# Altium schematic sheet MCU.SchDoc
size A4; DocumentNumber: 4; SheetNumber: 3; SheetTotal: 5
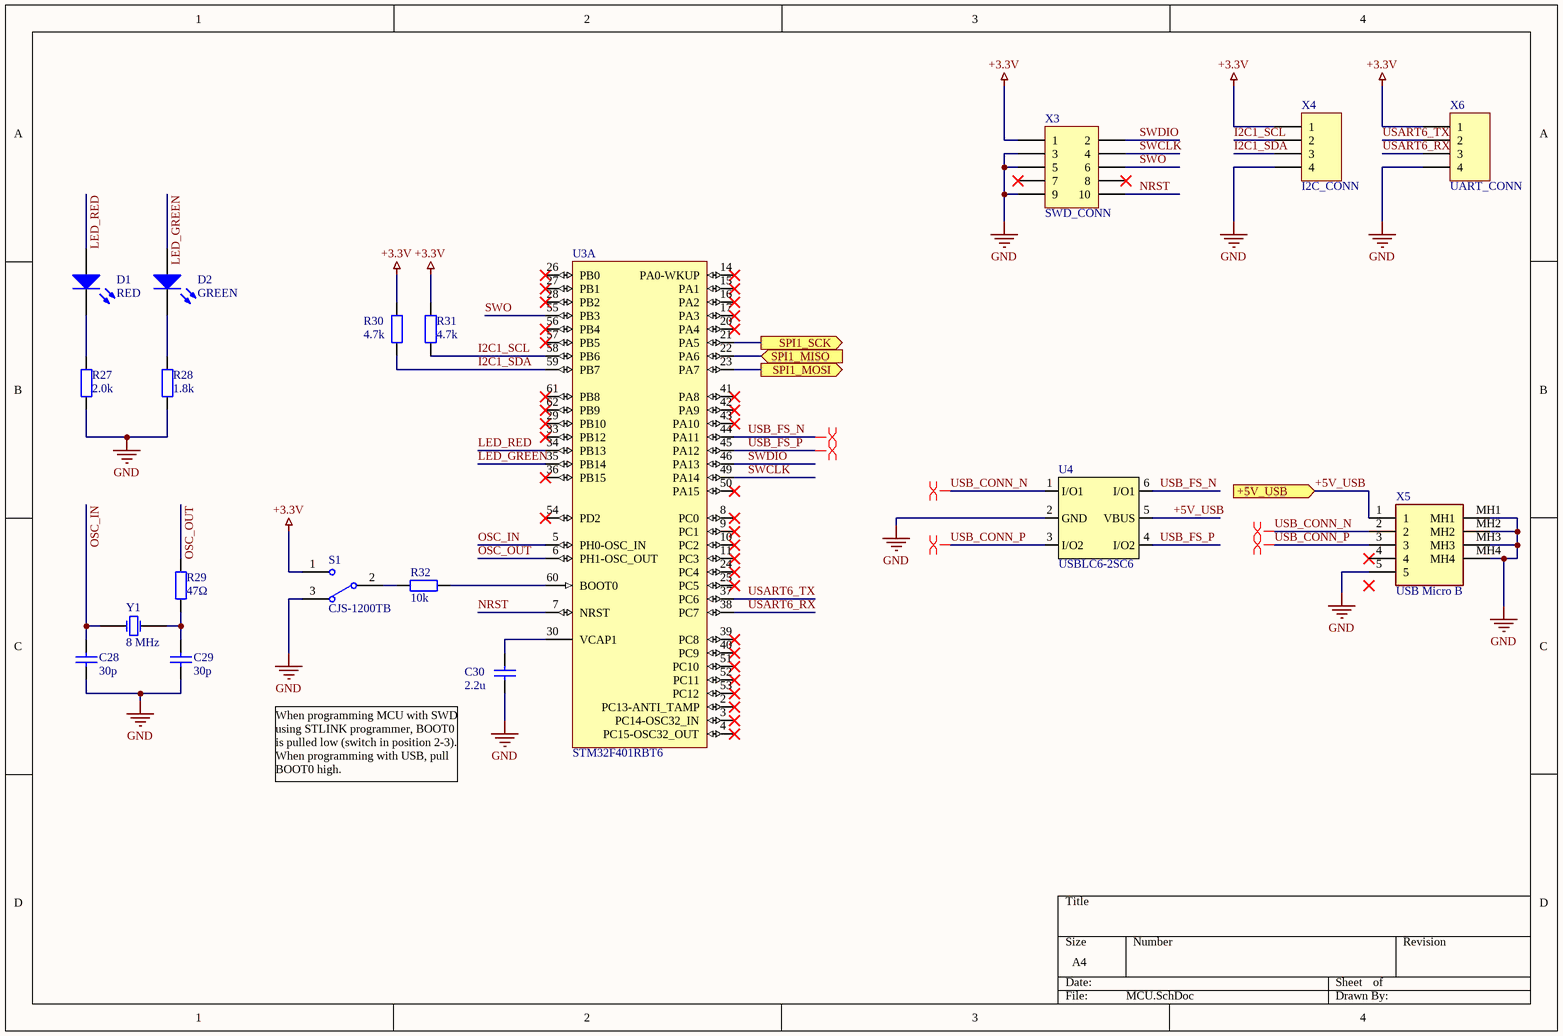
[diagram p0: MCU.SchDoc]

## Parts
C28  30p  [CAPC1608X87N]
C29  30p  [CAPC1608X87N]
C30  2.2u  [CAPC2012X110N]
D1  RED  [LEDC2012X110N]
D2  GREEN  [LEDC2012X110N]
R27  2.0k  [RESC1608X55N]
R28  1.8k  [RESC1608X55N]
R29  47Ω  [RESC1608X55N]
R30  4.7k  [RESC1608X55N]
R31  4.7k  [RESC1608X55N]
R32  10k  [RESC1608X55N]
S1  CJS-1200TB  [B-TYPE]
U3  STM32F401RBT6  [QFP50P1200X1200X160-64N]  (part A of 2)
U4  USBLC6-2SC6  [SOT95P280X145-6N]
X3  SWD_CONN  [SHDR10W55P200_2X5_1265X630X640P]
X4  I2C_CONN  [SHDR4W65P0X254_1X4_1262X660X1216P]
X5  USB Micro B  [UJ2MIBH24SMTTR]
X6  UART_CONN  [SHDR4W65P0X254_1X4_1262X660X1216P]
Y1  8 MHz  [ECS080185PXJESTR]

## Ports
+5V_USB (in), SPI1_MISO (in), SPI1_MOSI (out), SPI1_SCK (out)

## Nets
+3.3V: R30.2 R31.2 S1.1 X3.1 X4.1 X6.1
GND: C28.1 C29.1 C30.1 R27.1 R28.1 S1.3 U4.2(GND) X3.3 X3.5 X3.9 X4.4 X5.5 X5.MH1 X5.MH2 X5.MH3 X5.MH4 X6.4
+5V_USB: U4.5(VBUS) X5.1 ; port +5V_USB
I2C1_SCL: R31.1 U3.58(PB6) X4.2
I2C1_SDA: R30.1 U3.59(PB7) X4.3
LED_GREEN: D2.1(A) U3.35(PB14)
LED_RED: D1.1(A) U3.34(PB13)
NRST: U3.7(NRST) X3.10
OSC_IN: C28.2 U3.5(PH0-OSC_IN) Y1.1(OSC1)
OSC_OUT: R29.2 U3.6(PH1-OSC_OUT)
SPI1_MISO: U3.22(PA6) ; port SPI1_MISO
SPI1_MOSI: U3.23(PA7) ; port SPI1_MOSI
SPI1_SCK: U3.21(PA5) ; port SPI1_SCK
SWCLK: U3.49(PA14) X3.4
SWDIO: U3.46(PA13) X3.2
SWO: U3.55(PB3) X3.6
USART6_RX: U3.38(PC7) X6.3
USART6_TX: U3.37(PC6) X6.2
USB_CONN_N: U4.1(I/O1) X5.2
USB_CONN_P: U4.3(I/O2) X5.3
USB_FS_N: U3.44(PA11) U4.6(I/O1)
USB_FS_P: U3.45(PA12) U4.4(I/O2)
NetC29_2: C29.2 R29.1 Y1.2(OSC2)
NetC30_2: C30.2 U3.30(VCAP1)
NetD1_2: D1.2(K) R27.2
NetD2_2: D2.2(K) R28.2
NetR32_1: R32.1 U3.60(BOOT0)
NetR32_2: R32.2 S1.2

Not connected (* = marked no-connect by the designer): U3 2(PC13-ANTI_TAMP)* 3(PC14-OSC32_IN)* 4(PC15-OSC32_OUT)* 8(PC0)* 9(PC1)* 10(PC2)* 11(PC3)* 14(PA0-WKUP)* 15(PA1)* 16(PA2)* 17(PA3)* 20(PA4)* 24(PC4)* 25(PC5)* 26(PB0)* 27(PB1)* 28(PB2)* 29(PB10)* 33(PB12)* 36(PB15)* 39(PC8)* 40(PC9)* 41(PA8)* 42(PA9)* 43(PA10)* 50(PA15)* 51(PC10)* 52(PC11)* 53(PC12)* 54(PD2)* 56(PB4)* 57(PB5)* 61(PB8)* 62(PB9)*; X3 7* 8*; X5 4*

## Layout directives
differential pair: USB_CONN_N, USB_CONN_P, USB_FS_N, USB_FS_P

## Notes on the sheet
- When programming MCU with SWD using STLINK programmer, BOOT0 is pulled low (switch in position 2-3). When programming with USB, pull BOOT0 high.

## Library data of the parts
C28 C29 = Cap: Manufacturer 1: AVX; Manufacturer Part Number 1: 06035U300FAT2A
C30 = Cap: Manufacturer 1: Samsung Electro-Mechanics; Manufacturer Part Number 1: CL21B225KOFNNNE
D1 = LED1: Manufacturer 1: Lite-On; Manufacturer Part Number 1: LTST-C170CKT
D2 = LED1: Manufacturer 1: Lite-On; Manufacturer Part Number 1: LTST-C170KGKT
R27 = Res2: Manufacturer 1: Vishay/Dale; Manufacturer Part Number 1: CRCW06032K00FKEA
R28 = Res2: Manufacturer 1: Vishay/Dale; Manufacturer Part Number 1: CRCW060311K8FKEA
R29 = Res2
R30 R31 = Res2: Manufacturer 1: Vishay/Dale; Manufacturer Part Number 1: CRCW06034K70FKEA
R32 = Res2: Manufacturer 1: Yageo; Manufacturer Part Number 1: RC0603FR-0710KL; MOUSER Part Number: 603-RC0603FR-0710KL
S1 = SW-SPDT
U3 = STM32F401RBT6: Manufacturer 1: STMicroelectronics; Manufacturer Part Number 1: STM32F401RBT6
U4 = USBLC6: Manufacturer 1: STMicroelectronics; Manufacturer Part Number 1: USBLC6-2SC6
X3 = Header 5X2: Manufacturer 1: Molex; Manufacturer Part Number 1: 87831-1019
X4 X6 = Header 4: Manufacturer 1: Molex; Manufacturer Part Number 1: 171971-0004
X5 = UJ2-MIBH2-4-SMT-TR: Connector; Manufacturer_Name: CUI Devices; Datasheet Link: https://componentsearchengine.com//UJ2-MIBH2-4-SMT-TR.pdf; Height: 2.5mm; Mouser2 Part Number: 490-UJ2-MIBH2-4-SMT; Mouser2 Price/Stock: https://www.mouser.com/Search/Refine.aspx?Keyword=490-UJ2-MIBH2-4-SMT; Manufacturer_Part_Number: UJ2-MIBH2-4-SMT-TR
Y1 = XTAL: Manufacturer 1: ECS; Manufacturer Part Number 1: ECS-080-18-5PX-JES-TR